# EAGLE design snarfbasebasics232-v01 (EAGLE 5.11)
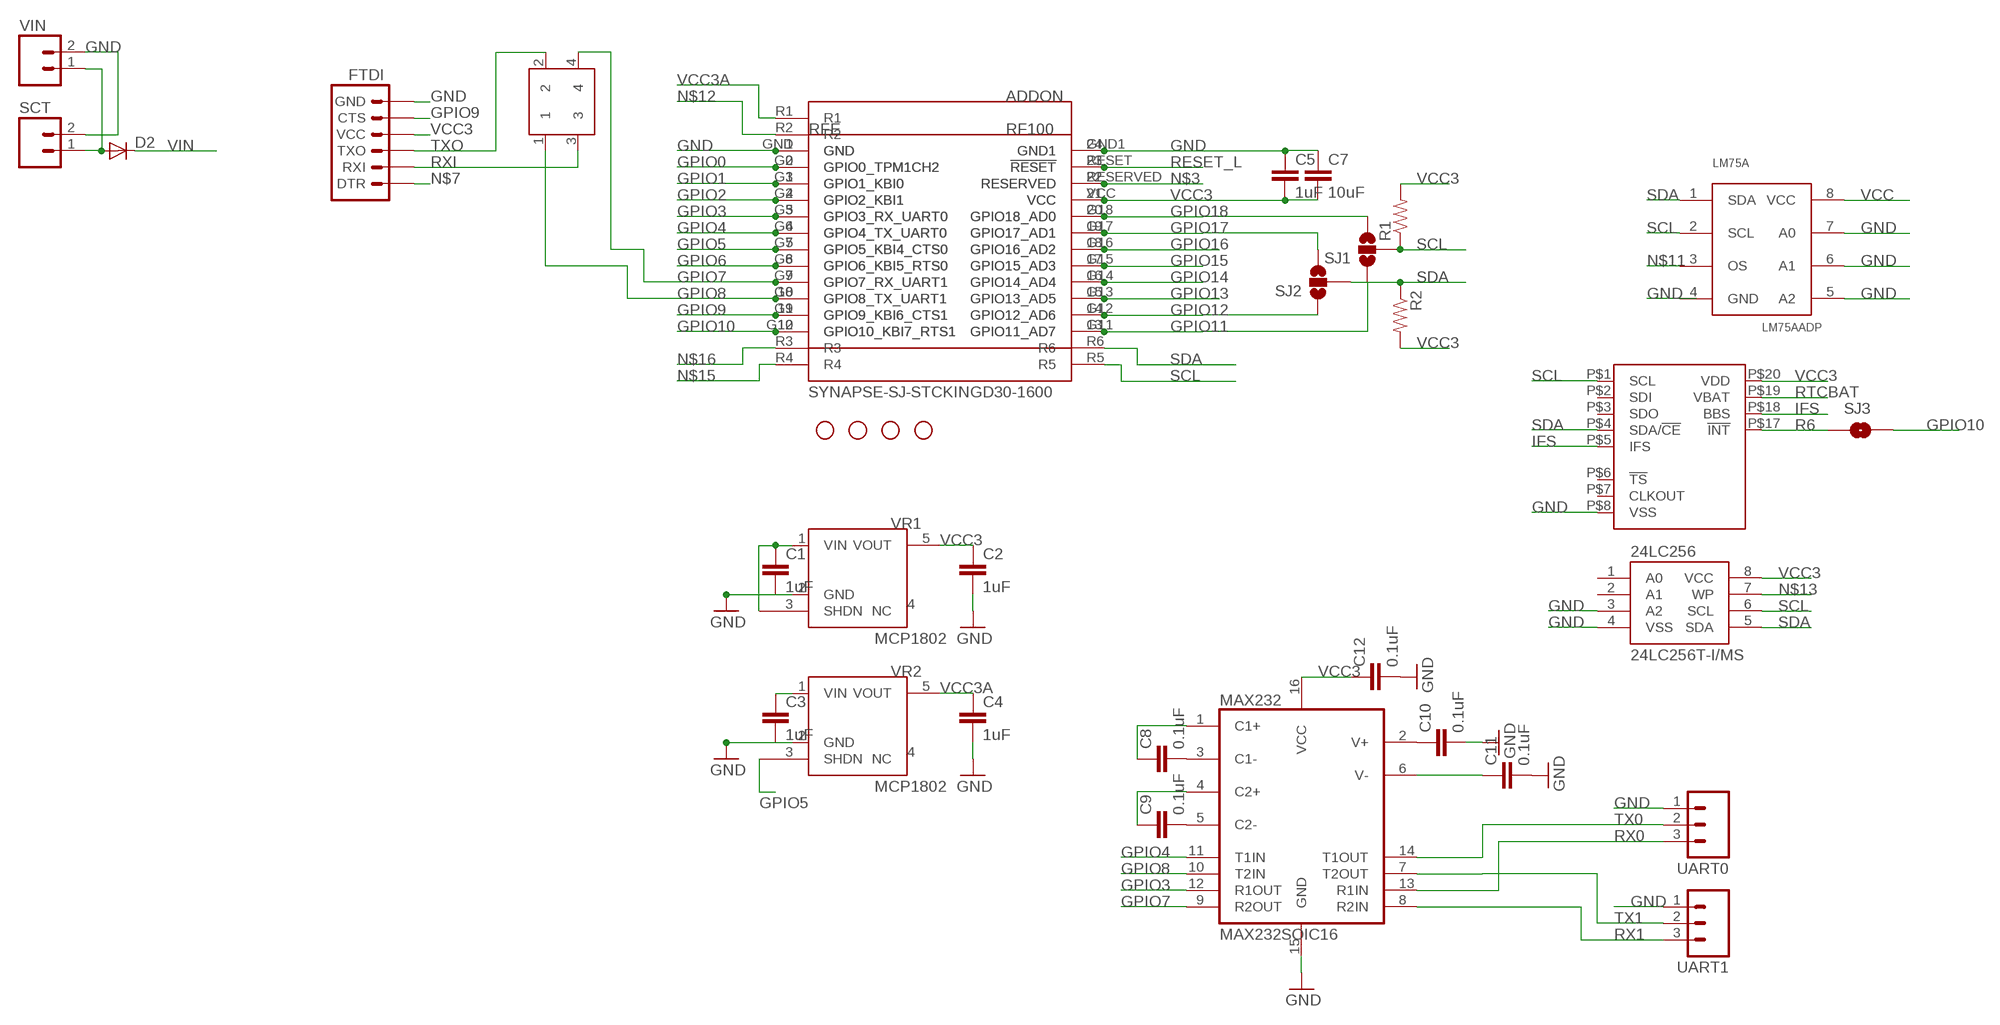
[diagram p0: schematic, sheet 1]

## Parts
24LC256  24LC256T-I/MS  EEPROM-I2CSMD  [SO08]
ADDON  SYNAPSE-SJ-STCKINGD30-1600  [SYNSJ-STACK]
C1  1uF  CAP0805  [0805]
C2  1uF  CAP0805  [0805]
C3  1uF  CAP0805  [0805]
C4  1uF  CAP0805  [0805]
C5  1uF  CAP0805  [0805]
C7  10uF  CAP0805  [0805]
C8  0.1uF  CAP0805  [0805]
C9  0.1uF  CAP0805  [0805]
C10  0.1uF  CAP0805  [0805]
C11  0.1uF  CAP0805  [0805]
C12  0.1uF  CAP0805  [0805]
D2  DIODESMA  [SMA-DIODE]
FTDI  ARDUINO_SERIAL_PROGRAMPTH  [1X06]
JP6  STAND-OFF  [STAND-OFF]
JP9  STAND-OFF  [STAND-OFF]
JP10  STAND-OFF  [STAND-OFF]
JP11  STAND-OFF  [STAND-OFF]
LM75A  LM75AADP  [TSSOP8]
MAX232  MAX232SOIC16  [SO016]
PCF2129A  PCF2129ASO20  [SO20W]
R1  RESISTOR  [0805]
R2  RESISTOR  [0805]
RFE  RFE  SYNAPSEWIRELESS-RFENGINE  [SYNAPSERFENGINE-THM-SMT]
RXTX  SERIAL_CROSSOVER  [2X02_PTH]
SCT  M023.5MM  [SCREWTERMINAL-3.5MM-2]
SJ1  SOLDERJUMPER_2WAYS  [SJ_3]
SJ2  SOLDERJUMPER_2WAYS  [SJ_3]
SJ3  SOLDERJUMPERNC2  [SJ_2S-NOTRACE]
UART0  M03PTH  [1X03]
UART1  M03PTH  [1X03]
VIN  M02PTH  [1X02]
VR1  MCP1802  [SOT23-5]
VR2  MCP1802  [SOT23-5]

## Nets
GND: 24LC256.3(A2) 24LC256.4(VSS) ADDON.GND ADDON.GND1 C1.2 C2.2 C3.2 C4.2 C5.1 C7.1 C10.2 C11.2 C12.2 FTDI.6(GND) LM75A.5(A2) LM75A.6(A1) LM75A.7(A0) MAX232.15(GND) PCF2129A.P$8(VSS) RFE.1(GND) RFE.24(GND1) SCT.2 UART0.1 UART1.1 VIN.2 VR1.2(GND) VR2.2(GND)
GPIO0: ADDON.G0(GPIO0_TPM1CH2) RFE.2(GPIO0_TPM1CH2)
GPIO1: ADDON.G1(GPIO1_KBI0) RFE.3(GPIO1_KBI0)
GPIO2: ADDON.G2(GPIO2_KBI1) RFE.4(GPIO2_KBI1)
GPIO3: ADDON.G3(GPIO3_RX_UART0) MAX232.12(R1OUT) RFE.5(GPIO3_RX_UART0)
GPIO4: ADDON.G4(GPIO4_TX_UART0) MAX232.11(T1IN) RFE.6(GPIO4_TX_UART0)
GPIO5: ADDON.G5(GPIO5_KBI4_CTS0) RFE.7(GPIO5_KBI4_CTS0) VR2.3(SHDN)
GPIO6: ADDON.G6(GPIO6_KBI5_RTS0) RFE.8(GPIO6_KBI5_RTS0)
GPIO7: ADDON.G7(GPIO7_RX_UART1) MAX232.9(R2OUT) RFE.9(GPIO7_RX_UART1) RXTX.4
GPIO8: ADDON.G8(GPIO8_TX_UART1) MAX232.10(T2IN) RFE.10(GPIO8_TX_UART1) RXTX.1
GPIO9: ADDON.G9(GPIO9_KBI6_CTS1) FTDI.5(CTS) RFE.11(GPIO9_KBI6_CTS1)
GPIO10: ADDON.G10(GPIO10_KBI7_RTS1) RFE.12(GPIO10_KBI7_RTS1) SJ3.2
GPIO11: ADDON.G11(GPIO11_AD7) RFE.13(GPIO11_AD7) SJ1.1
GPIO12: ADDON.G12(GPIO12_AD6) RFE.14(GPIO12_AD6) SJ2.1
GPIO13: ADDON.G13(GPIO13_AD5) RFE.15(GPIO13_AD5)
GPIO14: ADDON.G14(GPIO14_AD4) RFE.16(GPIO14_AD4)
GPIO15: ADDON.G15(GPIO15_AD3) RFE.17(GPIO15_AD3)
GPIO16: ADDON.G16(GPIO16_AD2) RFE.18(GPIO16_AD2)
GPIO17: ADDON.G17(GPIO17_AD1) RFE.19(GPIO17_AD1) SJ2.3
GPIO18: ADDON.G18(GPIO18_AD0) RFE.20(GPIO18_AD0) SJ1.3
IFS: PCF2129A.P$5(IFS) PCF2129A.P$18(BBS)
N$1: C8.2 MAX232.3(C1-)
N$2: D2.A SCT.1 VIN.1
N$3: ADDON.RESERVED RFE.22(RESERVED)
N$4: C9.2 MAX232.5(C2-)
N$5: C10.1 MAX232.2(V+)
N$6: C11.1 MAX232.6(V-)
N$7: FTDI.1(DTR)
N$8: C8.1 MAX232.1(C1+)
N$10: C9.1 MAX232.4(C2+)
N$11: LM75A.3(OS)
N$12: ADDON.R2
N$13: 24LC256.7(WP)
N$15: ADDON.R4
N$16: ADDON.R3
R6: PCF2129A.P$17(!INT) SJ3.1
RESET_L: ADDON.RESET(!RESET) RFE.23(!RESET)
RTCBAT: PCF2129A.P$19(VBAT)
RX0: MAX232.13(R1IN) UART0.3
RX1: MAX232.8(R2IN) UART1.3
RXI: FTDI.2(RXI) RXTX.3
SCL: 24LC256.6(SCL) ADDON.R5 LM75A.2(SCL) PCF2129A.P$1(SCL) R1.1 SJ1.2
SDA: 24LC256.5(SDA) ADDON.R6 LM75A.1(SDA) PCF2129A.P$4(SDA/!CE) R2.1 SJ2.2
TX0: MAX232.14(T1OUT) UART0.2
TX1: MAX232.7(T2OUT) UART1.2
TXO: FTDI.3(TXO) RXTX.2
VCC: LM75A.8(VCC)
VCC3: 24LC256.8(VCC) ADDON.VCC C2.1 C5.2 C7.2 C12.1 FTDI.4(VCC) MAX232.16(VCC) PCF2129A.P$20(VDD) R1.2 R2.2 RFE.21(VCC) VR1.5(VOUT)
VCC3A: ADDON.R1 C4.1 VR2.5(VOUT)
VIN: C1.1 C3.1 D2.C VR1.1(VIN) VR1.3(SHDN) VR2.1(VIN)
Unconnected: 24LC256.1(A0) 24LC256.2(A1) LM75A.4(GND) PCF2129A.P$2(SDI) PCF2129A.P$3(SDO) PCF2129A.P$6(!TS) PCF2129A.P$7(CLKOUT) VR1.4(NC) VR2.4(NC)

## Library data of the parts
24LC256 = SparkFun:EEPROM-I2C
ADDON = 0_jc-custom:SYNAPSE-SJ-STCKING: Standard layout for expansion modules using Synapse Wireless boards
C1-C5 C7-C12 = 0_jc-custom:CAP: Capacitor Standard 0603 ceramic capacitor, and 0.1" leaded capacitor.
D2 = SparkFun:DIODE: Diode These are standard reverse protection diodes and small signal diodes. SMA package can handle up to about 1A. SOD-323 can handle about 200mA. What the SOD-323 package when ordering, there are some mfgs out there that are 5-pin packages.
FTDI = SparkFun:ARDUINO_SERIAL_PROGRAM
JP6 JP9-JP11 = SparkFun:STAND-OFF: Stand Off This is the mechanical footprint for a #4 phillips button head screw. Use the keepout ring to avoid running the screw head into surrounding components. SKU : PRT-00447
LM75A = 0_jc-custom:LM75A
MAX232 = SparkFun:MAX232: RS232 Transceiver Very common IC. This is generically called 'MAX232', but works with the 3V equivalent MAX3232 generic ICs. Field tested and mother approved. Spark Fun Electronics SKU : COM-00316 (DIP) and COM-00589 (SMD)
PCF2129A = 0_jc-custom:PCF2129A
R1 R2 = SparkFun:RESISTOR: Resistor Basic schematic elements and footprints for 0603, 1206, and PTH 1/10th watt (small) resistors.
RFE = 0_jc-custom:SYNAPSEWIRELESS-RFENGINE
RXTX = 0_jc-custom:SERIAL_CROSSOVER
SCT VIN = SparkFun:M02: Header 2 Standard 2-pin 0.1" header. Use with straight break away headers (SKU : PRT-00116), right angle break away headers (PRT-00553), swiss pins (PRT-00743), machine pins (PRT-00117), and female headers (PRT-00115). Molex polarized connector foot print use with SKU : PRT-08233 with associated crimp pins and housings.
SJ1 SJ2 = SparkFun:SOLDERJUMPER_2WAY: Solder Jumper 2 way solder jumper
SJ3 = SparkFun:SOLDERJUMPER: Solder Jumper Standard SMD solder jumper. Used to automate production. Two varients : Normally Open and Normally Closed are the same, but have different paste layers. NC will have a large amount of paste and should jumper during reflow.
UART0 UART1 = SparkFun:M03: Header 3 Standard 3-pin 0.1" header. Use with straight break away headers (SKU : PRT-00116), right angle break away headers (PRT-00553), swiss pins (PRT-00743), machine pins (PRT-00117), and female headers (PRT-00115). Molex polarized connector foot print use with SKU : PRT-08232 with associated crimp pins and housings.
VR1 VR2 = 0_jc-custom:MCP1802

## Net classes
0 default: width 0.356 mm

## Board
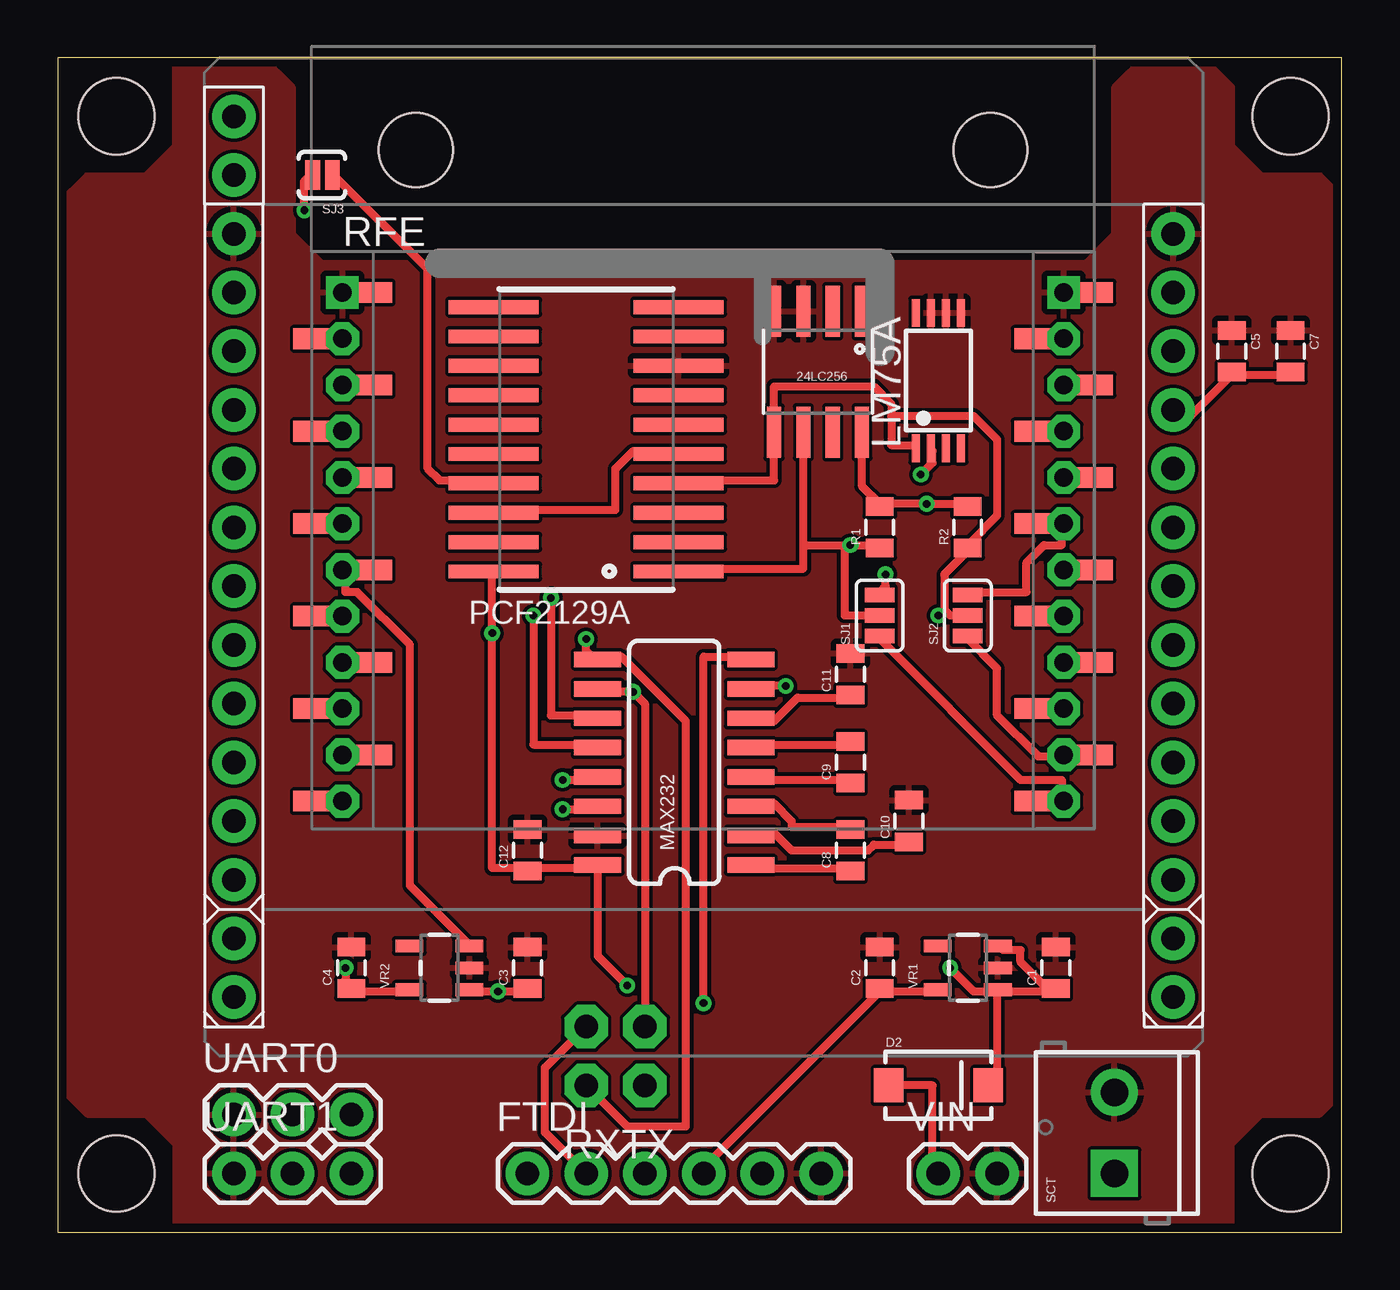
[diagram p1: board, top side]
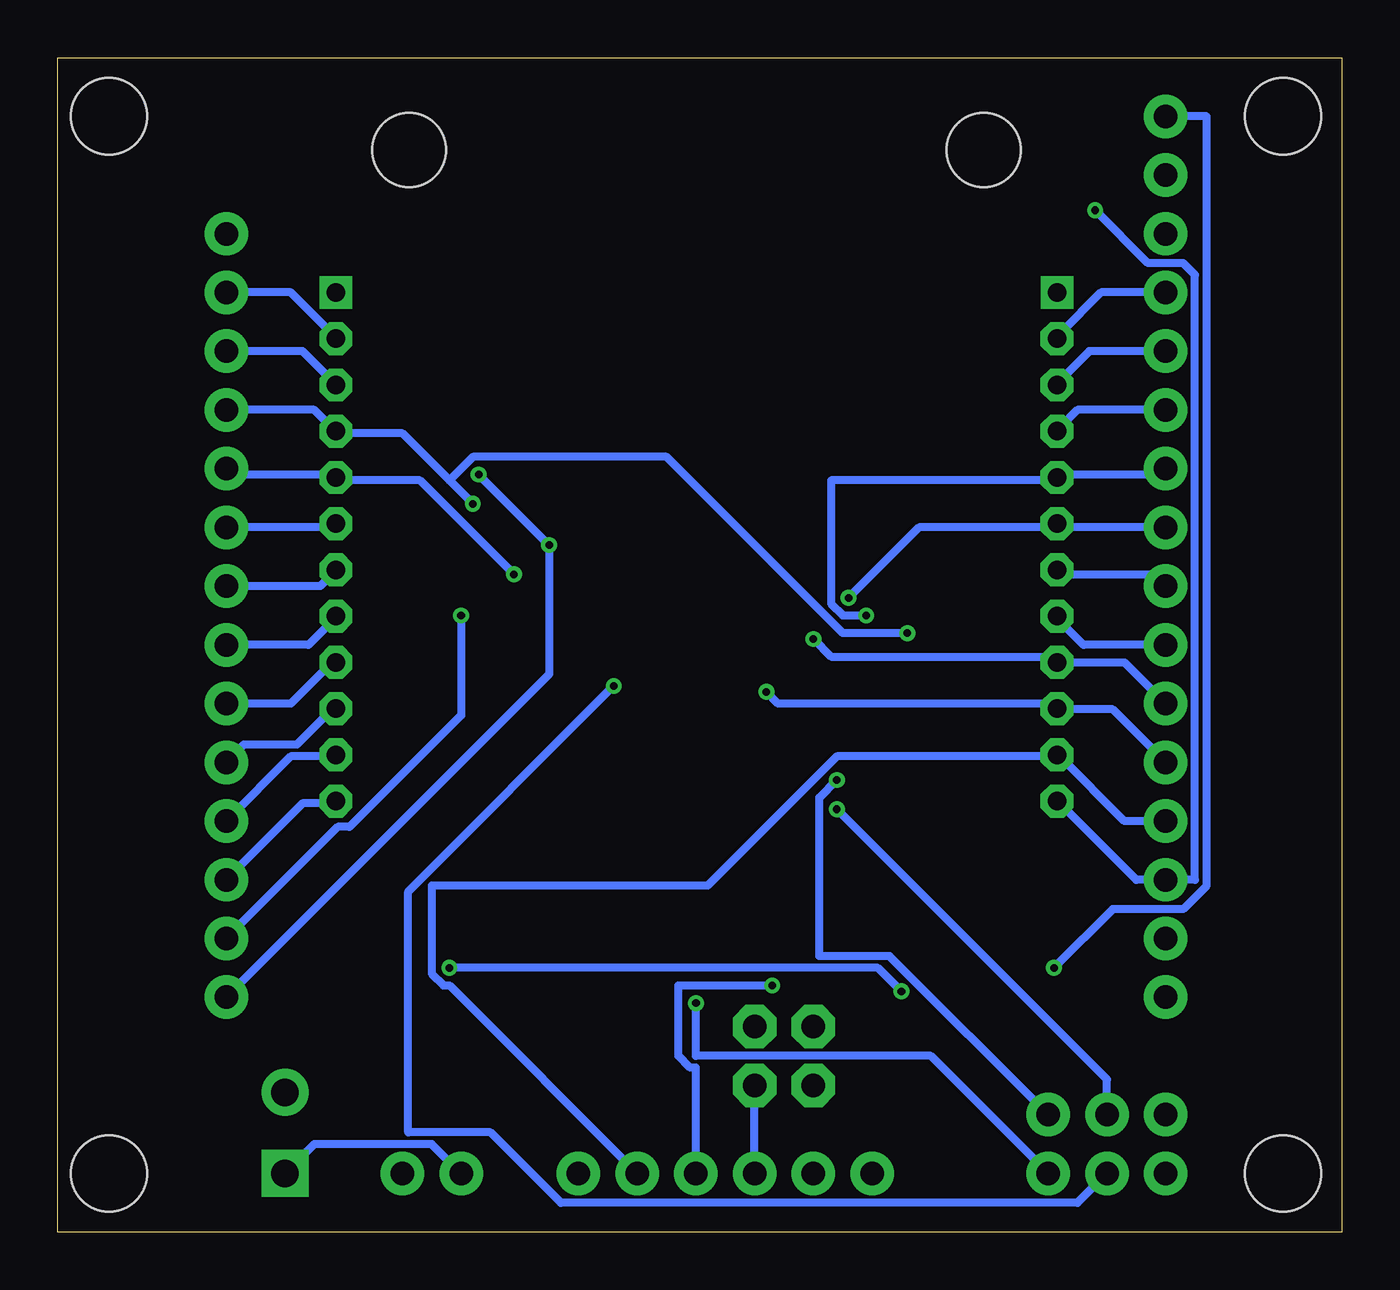
[diagram p2: board, bottom side, seen from below]

Size 55.55 x 50.79 mm. Coordinates in mm from the lower left corner, seen from the top.
Outline: 0,0 55.55,0 55.55,50.79 0,50.79 0,0
Copper layers (1*16): Top 0.0356mm / dielectric 1.5011mm / Bottom 0.0356mm
Design rules "LaenPCBOrder-JCModified": minimum track width 6mil, minimum drill 13mil, track to track 6mil, track to pad 6mil, pad to pad 6mil, via to via 6mil, smd to smd 6mil, copper to edge 15mil, drill to drill 6mil, minimum pad ring 12mil, minimum via ring 7mil, stop-mask expansion 4mil, vias tented up to drill 25mil, thermal gap 10mil

### Footprints (pad centres in the part's own frame; a part is rotated, then mirrored left to right if it is on the bottom)
SO08 = smd 0.61 x 2.21: 1 -1.905,-2.616; 2 -0.635,-2.616; 3 0.635,-2.616; 4 1.905,-2.616; 5 1.905,2.616; 6 0.635,2.616; 7 -0.635,2.616; 8 -1.905,2.616
SYNSJ-STACK = drill 1.016 pad 1.88 round: G0 0,-7.62; G1 0,-10.16; G2 0,-12.7; G3 0,-15.24; G4 0,-17.78; G5 0,-20.32; G6 0,-22.86; G7 0,-25.4; G8 0,-27.94; G9 0,-30.48; G10 0,-33.02; G11 40.64,-33.02; G12 40.64,-30.48; G13 40.64,-27.94; G14 40.64,-25.4; G15 40.64,-22.86; G16 40.64,-20.32; G17 40.64,-17.78; G18 40.64,-15.24; GND 0,-5.08; GND1 40.64,-5.08; R1 0,0; R2 0,-2.54; R3 0,-35.56; R4 0,-38.1; R5 40.64,-38.1; R6 40.64,-35.56; RESERVED 40.64,-10.16; RESET 40.64,-7.62; VCC 40.64,-12.7
0805 = smd 0.8 x 1.2: 1 -0.9,0; 2 0.9,0
SMA-DIODE = smd 1.27 x 1.47: A -2.15,0; C 2.15,0
1X06 = drill 1.016 pad 1.88 round: 1 0,0; 2 2.54,0; 3 5.08,0; 4 7.62,0; 5 10.16,0; 6 12.7,0
STAND-OFF = hole 3.302: 0,0
TSSOP8 = smd 1.2 x 0.35: 1 -2.925,0.975; 2 -2.925,0.325; 3 -2.925,-0.325; 4 -2.925,-0.975; 5 2.925,-0.975; 6 2.925,-0.325; 7 2.925,0.325; 8 2.925,0.975
SO016 = smd 0.66 x 2.032: 1 -4.445,-3.315; 2 -3.175,-3.315; 3 -1.905,-3.315; 4 -0.635,-3.315; 5 0.635,-3.315; 6 1.905,-3.315; 7 3.175,-3.315; 8 4.445,-3.315; 9 4.445,3.315; 10 3.175,3.315; 11 1.905,3.315; 12 0.635,3.315; 13 -0.635,3.315; 14 -1.905,3.315; 15 -3.175,3.315; 16 -4.445,3.315
SO20W = smd 0.6 x 3.9: P$1 -5.715,-4; P$2 -4.445,-4; P$3 -3.175,-4; P$4 -1.905,-4; P$5 -0.635,-4; P$6 0.635,-4; P$7 1.905,-4; P$8 3.175,-4; P$9 4.445,-4; P$10 5.715,-4; P$11 5.715,4; P$12 4.445,4; P$13 3.175,4; P$14 1.905,4; P$15 0.635,4; P$16 -0.635,4; P$17 -1.905,4; P$18 -3.175,4; P$19 -4.445,4; P$20 -5.715,4
SYNAPSERFENGINE-THM-SMT = drill 0.8 square: 1 0,0; 24 31.2,0 | drill 0.8 pad 1.422 octagon: 2 0,-2; 3 0,-4; 4 0,-6; 5 0,-8; 6 0,-10; 7 0,-12; 8 0,-14; 9 0,-16; 10 0,-18; 11 0,-20; 12 0,-22; 13 31.2,-22; 14 31.2,-20; 15 31.2,-18; 16 31.2,-16; 17 31.2,-14; 18 31.2,-12; 19 31.2,-10; 20 31.2,-8; 21 31.2,-6; 22 31.2,-4; 23 31.2,-2 | smd 1.67 x 0.89: P1 1.3,0; P2 -1.3,-2; P3 1.3,-4; P4 -1.3,-6; P5 1.3,-8; P6 -1.3,-10; P7 1.3,-12; P8 -1.3,-14; P9 1.3,-16; P10 -1.3,-18; P11 1.3,-20; P12 -1.3,-22; P13 29.9,-22; P14 32.5,-20; P15 29.9,-18; P16 32.5,-16; P17 29.9,-14; P18 32.5,-12; P19 29.9,-10; P20 32.5,-8; P21 29.9,-6; P22 32.5,-4; P23 29.9,-2; P24 32.5,0 | hole 3.2: 3.17,6.16; 28.03,6.16
2X02_PTH = drill 1.016 pad 1.88 octagon: 1 -1.27,-1.27; 2 -1.27,1.27; 3 1.27,-1.27; 4 1.27,1.27
SCREWTERMINAL-3.5MM-2 = drill 1.2 pad 2.032 square: 1 0,0 | drill 1.2 pad 2.032 round: 2 3.5,0
SJ_3 = smd 0.635 x 1.27: 1 -0.889,0; 2 0,0; 3 0.889,0
SJ_2S-NOTRACE = smd 0.635 x 1.27: 1 -0.45,0; 2 0.4,0
1X03 = drill 1.016 pad 1.88 round: 1 0,0; 2 2.54,0; 3 5.08,0
1X02 = drill 1.016 pad 1.88 round: 1 0,0; 2 2.54,0
SOT23-5 = smd 0.55 x 1.2: 1 -0.95,-1.3; 2 0,-1.3; 3 0.95,-1.3; 4 0.95,1.3; 5 -0.95,1.3

### Placement (x,y rotation side)
24LC256  32.89,37.21 180 top
ADDON  7.62,48.26 0 top
C1  43.18,11.43 90 top
C2  35.56,11.43 90 top
C3  20.32,11.43 90 top
C4  12.7,11.43 90 top
C5  50.8,38.1 270 top
C7  53.34,38.1 270 top
C8  34.29,16.51 90 top
C9  34.29,20.32 90 top
C10  36.83,17.78 90 top
C11  34.29,24.13 90 top
C12  20.32,16.51 90 top
D2  38.1,6.35 0 top
FTDI  20.32,2.54 0 top
JP6  53.34,2.54 0 top
JP9  2.54,2.54 0 top
JP10  53.34,48.26 0 top
JP11  2.54,48.26 0 top
LM75A  38.1,36.83 90 top
MAX232  26.67,20.32 90 top
PCF2129A  22.86,34.29 90 top
R1  35.56,30.48 90 top
R2  39.37,30.48 90 top
RFE  12.32,40.64 0 top
RXTX  24.13,7.62 180 top
SCT  45.72,2.54 90 top
SJ1  35.56,26.67 90 top
SJ2  39.37,26.67 90 top
SJ3  11.43,45.72 180 top
UART0  7.62,5.08 0 top
UART1  7.62,2.54 0 top
VIN  38.1,2.54 0 top
VR1  39.37,11.43 90 top
VR2  16.51,11.43 90 top

### Tracks (layer width: path | path; a pad name or v marks a point on that pad's centre or on a via)
GND
  pour Top: 0,41.91 0,6.35 1.27,5.08 3.81,5.08 5.08,3.81 5.08,0 50.8,0 50.8,3.81 52.07,5.08 54.61,5.08 55.88,6.35 55.88,41.91
  pour Top: 0,41.91 0,44.45 1.27,45.72 3.81,45.72 5.08,46.99 5.08,50.8 8.89,50.8 10.16,49.53 10.16,43.18 11.43,41.91 44.45,41.91 45.72,43.18 45.72,49.53 46.99,50.8 49.53,50.8 50.8,49.53 50.8,46.99 52.07,45.72 54.61,45.72 55.88,44.45 55.88,40.64 1.27,40.64
GPIO0
  Bottom 0.356: ADDON.G0 10.41,40.64 12.19,38.86 RFE.2
GPIO1
  Bottom 0.356: ADDON.G1 10.92,38.1 12.19,36.83 RFE.3
GPIO2
  Bottom 0.356: ADDON.G2 11.43,35.56 12.19,34.8 RFE.4
GPIO3  (via drill 0.33)
  Top 0.356: v20.57,26.67 20.57,21.08 23.11,21.08 MAX232.12
  Bottom 0.356: v20.57,26.67 21.59,26.67 22.1,27.18 22.1,32.51 12.45,32.51 RFE.5 12.19,32.77 7.87,32.77 ADDON.G3
GPIO4  (via drill 0.33)
  Top 0.356: v21.34,27.43 21.34,22.35 23.11,22.35 MAX232.11
  Bottom 0.356: v21.34,27.43 18.29,30.48 12.45,30.48 RFE.6 12.19,30.48 ADDON.G4
GPIO5
  Top 0.356: VR2.3 17.78,12.45 15.24,14.99 15.24,25.4 12.95,27.69 12.45,27.69 12.45,28.45 RFE.7
  Bottom 0.356: ADDON.G5 8.13,28.45 12.19,28.45 RFE.7
GPIO6
  Bottom 0.356: ADDON.G6 11.18,25.4 12.19,26.42 RFE.8
GPIO7  (via drill 0.33)
  Top 0.356: v22.86,25.65 22.86,25.15 23.11,24.89 MAX232.9 23.37,24.89 24.38,24.89 27.18,22.1 27.18,4.57 24.64,4.57 RXTX.4
  Bottom 0.356: v22.86,25.65 22.1,24.89 12.45,24.89 RFE.9 12.19,24.64 9.4,24.64 ADDON.G7
GPIO8  (via drill 0.33)
  Top 0.356: MAX232.10 23.37,23.37 v24.89,23.37 25.4,22.86 RXTX.1
  Bottom 0.356: v24.89,23.37 24.38,22.86 12.45,22.86 RFE.10 12.19,22.61 9.91,22.61 ADDON.G8
GPIO9
  Bottom 0.356: ADDON.G9 9.4,17.78 12.19,20.57 RFE.11 12.45,20.57 21.84,20.57 27.43,14.99 39.37,14.99 39.37,11.18 38.86,10.67 38.61,10.67 FTDI.5
GPIO10  (via drill 0.33)
  Top 0.356: v10.67,44.2 10.67,45.47 10.92,45.72 SJ3.2
  Bottom 0.356: v10.67,44.2 8.38,41.91 6.86,41.91 6.35,41.4 6.35,15.24 ADDON.G10 8.89,15.24 12.19,18.54 RFE.12
GPIO11
  Top 0.356: SJ1.1 35.56,25.65 41.66,19.56 43.43,19.56 43.43,18.8 RFE.13
  Bottom 0.356: ADDON.G11 44.96,18.54 43.69,18.54 RFE.13
GPIO12
  Top 0.356: SJ2.1 39.37,25.65 40.64,24.38 40.64,22.35 42.42,20.57 43.43,20.57 RFE.14
  Bottom 0.356: ADDON.G12 45.47,20.57 43.69,20.57 RFE.14
GPIO13
  Bottom 0.356: ADDON.G13 47.5,21.08 45.21,21.08 43.69,22.61 RFE.15
GPIO14
  Bottom 0.356: ADDON.G14 45.47,22.86 43.69,24.64 RFE.16
GPIO15
  Bottom 0.356: ADDON.G15 44.7,25.4 43.69,26.42 RFE.17
GPIO16
  Bottom 0.356: ADDON.G16 44.2,27.94 43.69,28.45 RFE.18
GPIO17
  Top 0.356: SJ2.3 39.37,27.69 41.91,27.69 41.91,28.96 42.67,29.72 43.43,29.72 43.43,30.48 RFE.19
  Bottom 0.356: ADDON.G17 43.69,30.48 RFE.19
GPIO18  (via drill 0.33)
  Top 0.356: v35.81,28.45 35.81,27.94 35.56,27.69 SJ1.3
  Bottom 0.356: v35.81,28.45 39.88,32.51 43.43,32.51 RFE.20 43.69,32.77 48.01,32.77 ADDON.G18
IFS
  Top 0.356: PCF2129A.P$18 19.05,31.24 24.13,31.24 24.13,33.02 24.89,33.78 26.67,33.78 PCF2129A.P$5
N$1
  Top 0.356: C8.2 34.29,17.53 31.75,17.53 31.75,17.78 30.99,18.54 30.23,18.54 MAX232.3
N$2
  Top 0.356: VIN.1 37.85,2.79 37.85,6.35 36.07,6.35 D2.A
  Bottom 0.356: SCT.1 44.45,3.81 39.37,3.81 VIN.1
N$3
  Bottom 0.356: ADDON.RESERVED 44.96,38.1 43.69,36.83 RFE.22
N$4
  Top 0.356: C9.2 34.29,21.08 30.23,21.08 MAX232.5
N$5
  Top 0.356: C10.1 36.83,16.76 35.31,16.76 35.05,16.51 31.75,16.51 30.99,17.27 30.23,17.27 MAX232.2
N$6
  Top 0.356: C11.1 34.29,23.11 32,23.11 30.99,22.1 30.23,22.1 MAX232.6
N$8
  Top 0.356: C8.1 34.29,15.75 30.23,15.75 MAX232.1
N$10
  Top 0.356: C9.1 34.29,19.56 30.23,19.56 MAX232.4
R6
  Top 0.356: SJ3.1 11.94,45.72 16,41.66 16,33.02 16.51,32.51 18.8,32.51 PCF2129A.P$17
RESET_L
  Bottom 0.356: ADDON.RESET 45.47,40.64 43.69,38.86 RFE.23
RX0  (via drill 0.33)
  Top 0.356: v21.84,19.56 23.11,19.56 MAX232.13
  Bottom 0.356: v21.84,19.56 22.61,18.8 22.61,11.94 19.56,11.94 UART0.3
RX1  (via drill 0.33)
  Top 0.356: v27.94,9.91 27.94,24.89 29.97,24.89 MAX232.8
  Bottom 0.356: v27.94,9.91 27.94,7.62 17.78,7.62 UART1.3
RXI
  Top 0.356: FTDI.2 21.08,4.32 21.08,7.11 RXTX.3
SCL  (via drill 0.33)
  Top 0.356: 32.26,29.72 34.04,29.72 | 34.04,29.72 v34.29,29.72 | v34.29,29.72 35.56,29.72 R1.1 | 32.26,29.72 32.26,34.54 24LC256.6 | v37.34,32.77 37.85,33.27 37.85,33.78 LM75A.2 | SJ1.2 34.04,26.67 34.04,29.72 | 34.04,29.72 v34.29,29.72 | 32.26,29.72 32.26,28.7 26.92,28.7 PCF2129A.P$1
  Bottom 0.356: v37.34,32.77 v34.29,29.72 34.29,24.13 ADDON.R5
SDA  (via drill 0.33)
  Top 0.356: 38.35,26.92 38.35,28.45 39.37,29.46 R2.1 39.37,29.72 40.64,30.99 40.64,34.29 39.62,35.31 36.07,35.31 | 38.35,26.92 38.61,26.67 SJ2.2 | 36.07,35.31 36.07,35.81 35.31,36.58 30.99,36.58 30.99,34.8 24LC256.5 30.99,34.54 30.99,32.51 26.92,32.51 PCF2129A.P$4 | 36.07,35.31 36.07,34.04 37.08,34.04 LM75A.1 | 38.35,26.92 v38.1,26.67
  Bottom 0.356: ADDON.R6 43.43,17.53 42.93,17.53 38.1,22.35 v38.1,26.67
TX0  (via drill 0.33)
  Top 0.356: v21.84,18.29 23.11,18.29 MAX232.14
  Bottom 0.356: v21.84,18.29 10.16,6.6 UART0.2
TX1  (via drill 0.33)
  Top 0.356: v31.5,23.62 30.23,23.62 MAX232.7
  Bottom 0.356: v31.5,23.62 40.39,14.73 40.39,4.32 36.83,4.32 33.78,1.27 11.43,1.27 UART1.2
TXO
  Bottom 0.356: FTDI.3 RXTX.2
VCC3  (via drill 0.33)
  Top 0.356: 35.56,31.5 34.8,32.26 34.8,34.54 24LC256.8 | 35.56,31.5 R1.2 35.56,31.5 | 35.56,31.5 v37.59,31.5 39.37,31.5 R2.2 | 50.8,37.08 53.34,37.08 C7.2 | 50.8,37.08 C5.2 50.8,37.08 | 50.8,37.08 49.02,35.31 48.26,35.31 ADDON.VCC | 35.56,10.41 37.85,10.41 VR1.5 | 35.56,10.41 C2.1 35.56,10.41 | 35.56,10.41 27.94,2.79 FTDI.4 | 20.32,15.75 23.11,15.75 MAX232.16 23.37,15.75 23.37,11.94 v24.64,10.67 | 20.32,15.75 C12.1 20.32,15.75 | 20.32,15.75 18.8,15.75 v18.8,25.91 18.8,28.45 PCF2129A.P$20
  Bottom 0.356: ADDON.VCC 44.45,35.56 43.69,34.8 RFE.21 43.43,34.54 40.64,34.54 38.61,32.51 | 38.61,32.51 v37.59,31.5 | FTDI.4 27.94,7.11 28.19,7.11 28.7,7.62 28.7,10.67 v24.64,10.67 | 38.61,32.51 37.59,33.53 29.21,33.53 21.59,25.91 v18.8,25.91
VCC3A  (via drill 0.33)
  Top 0.356: VR2.5 14.99,10.41 12.7,10.41 C4.1 12.7,10.67 12.45,10.92 v12.45,11.43
  Bottom 0.356: v12.45,11.43 9.91,13.97 6.86,13.97 5.84,14.99 5.84,48.26 ADDON.R1
VIN  (via drill 0.33)
  Top 0.356: VR2.1 18.03,10.41 v19.05,10.41 20.32,10.41 C3.1 | 42.67,10.41 43.18,10.41 C1.1 42.67,10.41 | 42.67,10.41 40.89,10.41 VR1.1 | 42.67,10.41 42.67,10.67 41.66,11.68 41.66,12.19 40.89,12.19 VR1.3 | 40.64,10.41 40.64,6.6 40.39,6.35 D2.C | 40.64,10.41 VR1.1 | v38.61,11.43 39.62,10.41 40.64,10.41 | 40.64,10.41 VR1.1
  Bottom 0.356: v19.05,10.41 20.07,11.43 v38.61,11.43